# EasyEDA Pro project ProPrj_stm32_2025-12-13.epro

# Schematic Schematic1_1
Board Name: Board1_1; Create Date: 2025-12-13; Page Name: P1; Project Name: stm32; Schematic Name: Schematic1_1; Update Date: 2025-12-13; Company: 嘉立创EDA; Page Size: A4; Version: V1.0
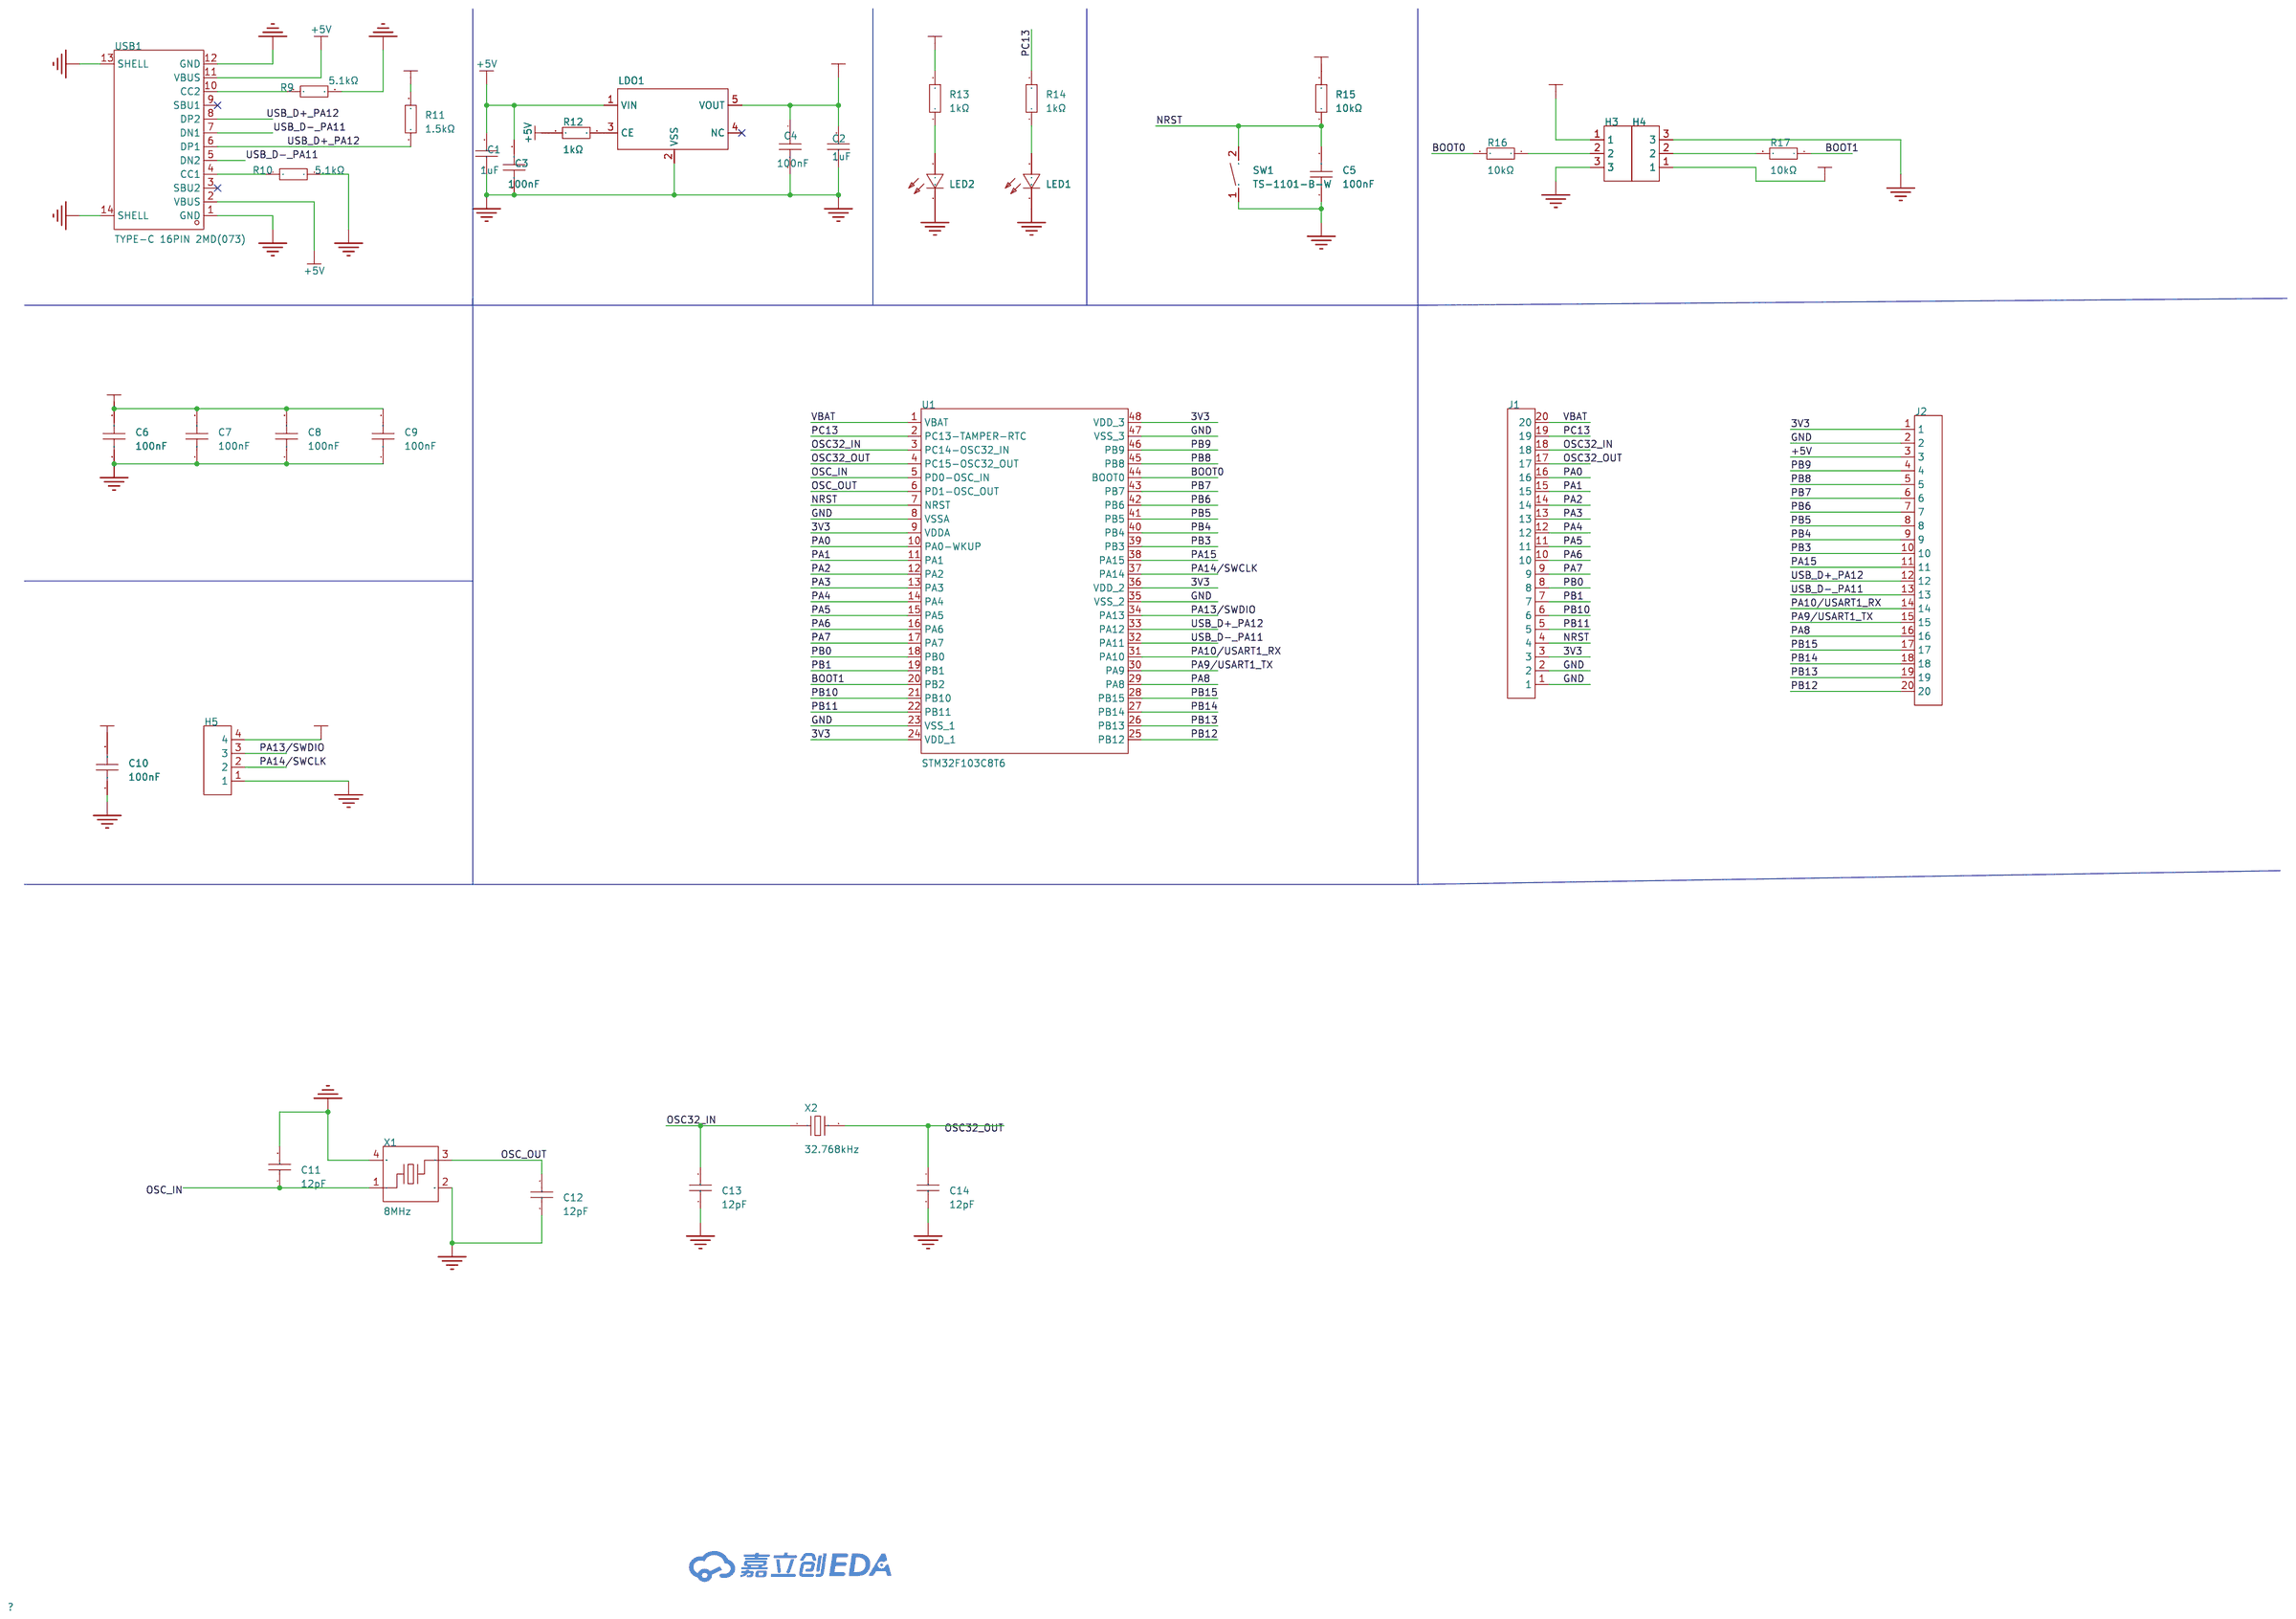
[diagram p0: schematic sheet]

## Parts
C1  1uF  [C0402]
C2  1uF  [C0402]
C3  100nF  [C0402]
C4  100nF  [C0402]
C5  100nF  [C0402]
C6  100nF  [C0402]
C7  100nF  [C0402]
C8  100nF  [C0402]
C9  100nF  [C0402]
C10  100nF  [C0402]
C11  12pF  [C0402]
C12  12pF  [C0402]
C13  12pF  [C0402]
C14  12pF  [C0402]
H3  PZ254V-11-03P  [HDR-TH_3P-P2.54-V-M]
H4  PZ254V-11-03P  [HDR-TH_3P-P2.54-V-M]
H5  DZ254W-11-04-65  [HDR-TH_4P-P2.54-H-M-W10.3]
J1  2.54-1*20P直针  [HDR-TH_20P-P2.54-V-M-1]
J2  2.54-1*20P直针  [HDR-TH_20P-P2.54-V-M-1]
LDO1  ME6211C33M5G-N  [SOT-23-5_L3.0-W1.7-P0.95-LS2.8-BL]
LED1  NCD0603R1  [LED0603-RD_RED]
LED2  NCD0603R1  [LED0603-RD_RED]
R9  5.1kΩ  [R0402]
R10  5.1kΩ  [R0402]
R11  1.5kΩ  [R0402]
R12  1kΩ  [R0603]
R13  1kΩ  [R0402]
R14  1kΩ  [R0402]
R15  10kΩ  [R0402]
R16  10kΩ  [R0402]
R17  10kΩ  [R0402]
SW1  TS-1101-B-W  [KEY-SMD_2P-L6.0-W3.6-P7.4-LS8.0-L]
U1  STM32F103C8T6  [LQFP-48_L7.0-W7.0-P0.50-LS9.0-BL]
USB1  TYPE-C 16PIN 2MD(073)  [USB-C-SMD_TYPE-C-6PIN-2MD-073]
X1  8MHz  [CRYSTAL-SMD_4P-L3.2-W2.5-BL-1]
X2  32.768kHz  [OSC-SMD_L3.2-W1.5]

## Library data of the parts
C1 C2 = CL05A105KP5NNNC: 容值:1uF;精度:±10%;额定电压:10V;温度系数:X5R;; LCSC Part Name: 1uF ±10% 10V; Supplier Part: C14445; Manufacturer: SAMSUNG(三星); Supplier Footprint: 0402; JLCPCB Part Class: 扩展库; Datasheet: https://item.szlcsc.com/datasheet/CL05A105KP5NNNC/15107.html; Supplier: LCSC; Tolerance: ±10%; Voltage Rating: 10V; Temperature Coefficient: X5R
C3-C10 = GRM155R71H104KE14D: 容值:100nF;精度:±10%;额定电压:50V;温度系数:X7R;; LCSC Part Name: 100nF ±10% 50V; Supplier Part: C77020; Manufacturer: muRata(村田); Supplier Footprint: 0402; JLCPCB Part Class: 扩展库; Datasheet: https://item.szlcsc.com/datasheet/GRM155R71H104KE14D/78147.html; Supplier: LCSC; Tolerance: ±10%; Voltage Rating: 50V; Temperature Coefficient: X7R
C11-C14 = 0402CG120J500NT: 容值:12pF;精度:±5%;额定电压:50V;温度系数:C0G;; LCSC Part Name: 12pF ±5% 50V; Supplier Part: C1547; Manufacturer: FH(风华); Supplier Footprint: 0402; JLCPCB Part Class: 基础库; Datasheet: https://item.szlcsc.com/datasheet/0402CG120J500NT/1899.html; Supplier: LCSC; Tolerance: ±5%; Voltage Rating: 50V; Temperature Coefficient: C0G
H3 H4 = PZ254V-11-03P: 插针结构:1x3P;间距:2.54mm;行距:-;圆针/方针:方针;安装方式:直插;排数:单排;总PIN位数:3P;额定电流:3A;额定电压:250V;配合针长度:6mm;塑高:2.5mm;端接针长度:3mm;工作温度:-40℃~+105℃;颜色:黑色;; LCSC Part Name: 1x3P 间距:2.54mm 方针 直插; Supplier Part: C2937625; Manufacturer: XFCN(兴飞); Supplier Footprint: 插件,P=2.54mm; JLCPCB Part Class: 扩展库; Datasheet: https://item.szlcsc.com/datasheet/PZ254V-11-03P/3293280.html; Supplier: LCSC; Pin Structure: 1x3P; Pitch: 2.54mm; Circluar Pins/Square Pins: 方针; Mounting Type: 直插; Number of Rows: 单排; Number of Pins: 3P; Current Rating: 3A; Voltage Rating (Max): 250V; Length of Mating Pin: 6mm; Insulation Height: 2.5mm; Length of End Connection Pin: 3mm; Operating Temperature: -40℃~+105℃; Color: 黑色
H5 = DZ254W-11-04-65: 插针结构:1x4P;间距:2.54mm;行距:-;圆针/方针:方针;安装方式:弯插;排数:单排;总PIN位数:4P;额定电流:3A;额定电压:-;配合针长度:6mm;塑高:2.54mm;端接针长度:-;触头材质:黄铜;触头镀层:金;工作温度:-;颜色:黑色;; LCSC Part Name: 1x4P 间距:2.54mm 方针 弯插; Supplier Part: C2935929; Manufacturer: DEALON(德艺隆); Supplier Footprint: 弯插,P=2.54mm; JLCPCB Part Class: 扩展库; Datasheet: https://item.szlcsc.com/datasheet/DZ254W-11-04-65/3287507.html; Supplier: LCSC; Pin Structure: 1x4P; Pitch: 2.54mm; Circluar Pins/Square Pins: 方针; Mounting Type: 弯插; Number of Rows: 单排; Number of Pins: 4P; Current Rating: 3A; Length of Mating Pin: 6mm; Insulation Height: 2.54mm; Contact Material: 黄铜; Contact Plating: 金; Color: 黑色
J1 J2 = 2.54-1*20P直针: 插针结构:1x20P;间距:2.54mm;行距:-;圆针/方针:方针;安装方式:直插;排数:单排;总PIN位数:20P;额定电流:3A;额定电压:-;配合针长度:-;塑高:-;端接针长度:-;触头材质:黄铜;触头镀层:-;工作温度:-40℃~+105℃;颜色:黑色;; LCSC Part Name: 1x20P 间距:2.54mm 方针 直插; Supplier Part: C50981; Manufacturer: BOOMELE(博穆精密); Supplier Footprint: 插件,P=2.54mm; JLCPCB Part Class: 扩展库; Datasheet: https://item.szlcsc.com/datasheet/2.54-1*20P%25E7%259B%25B4%25E9%2592%2588/51993.html; Supplier: LCSC; Pin Structure: 1x20P; Pitch: 2.54mm; Circluar Pins/Square Pins: 方针; Mounting Type: 直插; Number of Rows: 单排; Number of Pins: 20P; Current Rating: 3A; Contact Material: 黄铜; Operating Temperature: -40℃~+105℃; Color: 黑色
LDO1 = ME6211C33M5G-N: 输出类型:固定;工作电压:6V;输出电压:3.3V;输出电流:500mA;电源纹波抑制比(PSRR):70dB@(1kHz);输出极性:正极;; LCSC Part Name: 输入6V 输出3.3V 500mA; Supplier Part: C82942; Manufacturer: MICRONE(南京微盟); Supplier Footprint: SOT-23-5; JLCPCB Part Class: 扩展库; Datasheet: https://item.szlcsc.com/datasheet/ME6211C33M5G-N/84106.html; Supplier: LCSC; Output Type: 固定; Voltage - Supply: 6V; Output Voltage: 3.3V; Output Current: 500mA; Power Supply Rejection Ratio (PSRR): 70dB@(1kHz); Voltage Dropout: 120mV@(100mA); standby current: 60uA; Noise: 50uVrms; Features: 过流保护；带使能；短路保护; Operating Temperature: -40℃~+150℃; Output Configuration: 正极; Number of Outputs: 1
LED1 LED2 = NCD0603R1_C84263: 灯头类型:-;发光颜色:红色;正向压降(Vf):1.6V~2.6V;功率:65mW;正向电流:25mA;波长:615nm~630nm;二极管配置:独立二极管;透镜颜色:-;色温:-;发光强度:220mcd;发光角度:130°;载带方式:-;工作温度:-30℃~+85℃;; LCSC Part Name: 片式发光二极管; Supplier Part: C84263; Manufacturer: 国星光电; Supplier Footprint: 0603; JLCPCB Part Class: 扩展库; Datasheet: https://item.szlcsc.com/datasheet/NCD0603R1/85432.html; Supplier: LCSC; Illumination Color: 红色; Voltage - Forward(Vf): 1.6V~2.6V; Power(Watts): 65mW; Forward Current: 25mA; Wavelength - Dominant: 615nm~630nm; Peak Wavelength: 630nm; Diode Configuration: 独立二极管; Luminous Intensity: 220mcd; Viewing Angle: 130°; Operating Temperature: -30℃~+85℃
R9 R10 = 0402WGF5101TCE: 电阻类型:厚膜电阻;阻值:5.1kΩ;精度:±1%;功率:62.5mW;工作电压:50V;温度系数:±100ppm/℃;; LCSC Part Name: 5.1kΩ ±1% 62.5mW 厚膜电阻; Supplier Part: C25905; Manufacturer: UNI-ROYAL(厚声); Supplier Footprint: 0402; JLCPCB Part Class: 基础库; Datasheet: https://item.szlcsc.com/datasheet/0402WGF5101TCE/26648.html; Supplier: LCSC; Type: 厚膜电阻; Tolerance: ±1%; Power(Watts): 62.5mW; Voltage-Supply(Max): 50V; Temperature Coefficient: ±100ppm/℃; Operating Temperature: -55℃~+155℃
R11 = 0402WGF1501TCE: 电阻类型:厚膜电阻;阻值:1.5kΩ;精度:±1%;功率:62.5mW;最大工作电压:50V;温度系数:±100ppm/℃;; LCSC Part Name: 1.5kΩ ±1% 62.5mW 厚膜电阻; Supplier Part: C25867; Manufacturer: UNI-ROYAL(厚声); Supplier Footprint: 0402; JLCPCB Part Class: 基础库; Datasheet: https://atta.szlcsc.com/upload/public/pdf/source/20200306/C422600_1E6D84923E4A46A82E41ADD87F860B5C.pdf; Supplier: LCSC; Type: 厚膜电阻; Tolerance: ±1%; Power(Watts): 62.5mW; Overload Voltage (Max): 50V; Temperature Coefficient: ±100ppm/℃; Operating Temperature Range: -55℃~+155℃
R12 = 0603WAF1001T5E: 电阻类型:厚膜电阻;阻值:1kΩ;精度:±1%;功率:100mW;工作电压:75V;温度系数:±100ppm/℃;; LCSC Part Name: 1kΩ ±1% 100mW 厚膜电阻; Supplier Part: C21190; Manufacturer: UNI-ROYAL(厚声); Supplier Footprint: 0603; JLCPCB Part Class: 基础库; Datasheet: https://item.szlcsc.com/datasheet/0603WAF1001T5E/21904.html; Supplier: LCSC; Type: 厚膜电阻; Tolerance: ±1%; Power(Watts): 100mW; Voltage-Supply(Max): 75V; Temperature Coefficient: ±100ppm/℃; Operating Temperature: -55℃~+155℃
R13 R14 = 0402WGF1001TCE: 电阻类型:厚膜电阻;阻值:1kΩ;精度:±1%;功率:62.5mW;工作电压:50V;温度系数:±100ppm/℃;; LCSC Part Name: 1kΩ ±1% 62.5mW 厚膜电阻; Supplier Part: C11702; Manufacturer: UNI-ROYAL(厚声); Supplier Footprint: 0402; JLCPCB Part Class: Basic Part; Datasheet: https://item.szlcsc.com/datasheet/0402WGF1001TCE/12256.html; Supplier: LCSC; Type: 厚膜电阻; Tolerance: ±1%; Power(Watts): 62.5mW; Voltage-Supply(Max): 50V; Temperature Coefficient: ±100ppm/℃; Operating Temperature: -55℃~+155℃
R15-R17 = RC0402FR-0710KL: 电阻类型:厚膜电阻;阻值:10kΩ;精度:±1%;功率:62.5mW;工作电压:50V;温度系数:±100ppm/℃;; LCSC Part Name: 厚膜电阻 10kΩ ±1% 62.5mW; Supplier Part: C60490; Manufacturer: YAGEO(国巨); Supplier Footprint: 0402; JLCPCB Part Class: 扩展库; Datasheet: https://item.szlcsc.com/datasheet/RC0402FR-0710KL/61542.html; Supplier: LCSC; Type: 厚膜电阻; Tolerance: ±1%; Power(Watts): 62.5mW; Voltage-Supply(Max): 50V; Temperature Coefficient: ±100ppm/℃; Operating Temperature: -55℃~+155℃
SW1 = TS-1101-B-W_C500065: 电路结构:单刀单掷;按钮形状:矩形按钮;作用力:1.6N;安装方式:立贴;开关长度:6mm;开关宽度:3.6mm;开关高度:2.5mm;带支架:不带支架;触点电流:50mA;额定电压:12V;带灯:无;工作寿命:5万次;; LCSC Part Name: 6*3.6*2.5mm 立贴 轻触开关; Supplier Part: C500065; Manufacturer: XKB Connection(中国星坤); Supplier Footprint: SMD; JLCPCB Part Class: 扩展库; Datasheet: https://item.szlcsc.com/datasheet/TS-1101-B-W/512191.html; Supplier: LCSC; Circuit: 单刀单掷; Actuator Style: 矩形按钮; Operating Force: 1.6N; Mounting Type: 立贴; Length: 6mm; Width: 3.6mm; Switch Height: 2.5mm; with Bracket: 不带支架; Contact Current: 50mA; Voltage Rating: 12V; Actuator/Cap Color: 白色; With Lamp: 无; Life: 5万次; Operating Temperature: -30℃~+85℃
U1 = STM32F103C8T6: CPU内核:ARM-M3;CPU最大主频:72MHz;应用领域:-;; LCSC Part Name: 主流增强型ARM Cortex-M3 MCU，具有64 KB Flash、72 MHz CPU、电机控制、USB和CAN; Supplier Part: C8734; Manufacturer: ST(意法半导体); Supplier Footprint: LQFP-48(7x7); JLCPCB Part Class: Extended Part; Datasheet: https://item.szlcsc.com/datasheet/STM32F103C8T6/9243.html; Supplier: LCSC; CPU Core: ARM-M3; CPU Maximum Speed: 72MHz; Program Storage Size: 64KB; Program Memory Type: FLASH; Number of I/O: 37; ADC (Bit): 12bit; Voltage - Supply: 2V~3.6V
USB1 = TYPE-C 16PIN 2MD(073): 连接器类型:Type-C;协议标准:-;公母:母;安装方式:卧贴;触点数量:16P;端口数量:1;额定电流 - 电源:3A;工作温度:-25℃~+85℃;; LCSC Part Name: Type-C 母 卧贴; Supplier Part: C2765186; Manufacturer: SHOU HAN(首韩); Supplier Footprint: SMD; JLCPCB Part Class: 扩展库; Datasheet: https://item.szlcsc.com/datasheet/TYPE-C%252016PIN%25202MD(073)/2901843.html; Supplier: LCSC; Connector Type: Type-C; Gender: 母; Mounting Type: 卧贴; Number of Contacts: 16P; Number of Ports: 1; Current Rating-Power: 3A; Voltage Rating: 5V; Connect-Disconnect Life: 5千次; Detection color: 黑色; Operating Temperature: -25℃~+85℃
X1 = XL2EL89COI-111YLC-8M: 晶振类型:贴片晶振;频率:8MHz;常温频差:±10ppm;负载电容:12pF;频率稳定度:±20ppm;; LCSC Part Name: YSX321SL 8MHZ 4P 3225 12PF ±10PPM -40~85℃ (±20PPM); Supplier Part: C2973805; Manufacturer: YXC(扬兴晶振); Supplier Footprint: SMD3225-4P; JLCPCB Part Class: 扩展库; Datasheet: https://item.szlcsc.com/datasheet/XL2EL89COI-111YLC-8M/3371202.html; Supplier: LCSC; Type: 贴片晶振; Normal temperature Frequency Tolerance: ±10ppm; Load Capacitance: 12pF; Frequency Stability: ±20ppm; Equivalent Series Resistance(ESR): 150Ω; Operating Temperature: -40℃~+85℃
X2 = X321532768KGD2SI: 晶振类型:贴片晶振;频率:32.768kHz;常温频差:±20ppm;负载电容:12.5pF;频率稳定度:±30ppm;; LCSC Part Name: YST310S 32.768KHZ 2P 3215 12.5PF ±20PPM -40~85℃; Supplier Part: C620155; Manufacturer: YXC(扬兴晶振); Supplier Footprint: SMD3215-2P; JLCPCB Part Class: Extended Part; Datasheet: https://item.szlcsc.com/datasheet/X321532768KGD2SI/649983.html; Supplier: LCSC; Type: 贴片晶振; Normal temperature Frequency Tolerance: ±20ppm; Load Capacitance: 12.5pF; Frequency Stability: ±30ppm; Operating Temperature: -40℃~+85℃

## Nets
3.3V: C2.2 C4.1 LDO1.5(VOUT) R11.2
3V3: C6.2 C7.2 C8.2 C9.2 C10.2 H3.1 H4.1 H5.4 J1.3 J2.1 R13.2 R15.2 U1.9(VDDA) U1.24(VDD_1) U1.36(VDD_2) U1.48(VDD_3)
+5V: C1.2 C3.1 J2.3 LDO1.1(VIN) R12.1 USB1.2(VBUS) USB1.11(VBUS)
GND: C1.1 C2.1 C3.2 C4.2 C5.1 C6.1 C7.1 C8.1 C9.1 C10.1 C11.2 C12.1 C13.1 C14.1 H3.3 H4.3 H5.1 J1.1 J1.2 J2.2 LDO1.2(VSS) LED1.1(K) LED2.1(K) R9.2 R10.2 SW1.1 U1.8(VSSA) U1.23(VSS_1) U1.35(VSS_2) U1.47(VSS_3) USB1.1(GND) USB1.12(GND) USB1.13(SHELL) USB1.14(SHELL) X1.2(GND) X1.4(GND)
VBAT: J1.20 U1.1(VBAT)
BOOT0: R16.2 U1.44(BOOT0)
BOOT1: R17.1 U1.20(PB2)
NRST: C5.2 J1.4 R15.1 SW1.2 U1.7(NRST)
OSC32_IN: C13.2 J1.18 U1.3(PC14-OSC32_IN) X2.1
OSC32_OUT: C14.2 J1.17 U1.4(PC15-OSC32_OUT) X2.2
OSC_IN: C11.1 U1.5(PD0-OSC_IN) X1.1
OSC_OUT: C12.2 U1.6(PD1-OSC_OUT) X1.3
PA0: J1.16 U1.10(PA0-WKUP)
PA1: J1.15 U1.11(PA1)
PA2: J1.14 U1.12(PA2)
PA3: J1.13 U1.13(PA3)
PA4: J1.12 U1.14(PA4)
PA5: J1.11 U1.15(PA5)
PA6: J1.10 U1.16(PA6)
PA7: J1.9 U1.17(PA7)
PA8: J2.16 U1.29(PA8)
PA9/USART1_TX: J2.15 U1.30(PA9)
PA10/USART1_RX: J2.14 U1.31(PA10)
PA13/SWDIO: H5.3 U1.34(PA13)
PA14/SWCLK: H5.2 U1.37(PA14)
PA15: J2.11 U1.38(PA15)
PB0: J1.8 U1.18(PB0)
PB1: J1.7 U1.19(PB1)
PB3: J2.10 U1.39(PB3)
PB4: J2.9 U1.40(PB4)
PB5: J2.8 U1.41(PB5)
PB6: J2.7 U1.42(PB6)
PB7: J2.6 U1.43(PB7)
PB8: J2.5 U1.45(PB8)
PB9: J2.4 U1.46(PB9)
PB10: J1.6 U1.21(PB10)
PB11: J1.5 U1.22(PB11)
PB12: J2.20 U1.25(PB12)
PB13: J2.19 U1.26(PB13)
PB14: J2.18 U1.27(PB14)
PB15: J2.17 U1.28(PB15)
PC13: J1.19 R14.2 U1.2(PC13-TAMPER-RTC)
USB_D+_PA12: J2.12 R11.1 U1.33(PA12) USB1.6(DP1) USB1.8(DP2)
USB_D-_PA11: J2.13 U1.32(PA11) USB1.5(DN2) USB1.7(DN1)
$1N481: R9.1 USB1.10(CC2)
$1N493: R10.1 USB1.4(CC1)
$1N1175: LDO1.3(CE) R12.2
$1N1788: LED1.2(A) R14.1
$1N1790: LED2.2(A) R13.1
$1N2803: H3.2 R16.1
$1N3005: H4.2 R17.2

Not connected (* = marked no-connect by the designer): LDO1 4(NC)*; USB1 3(SBU2)* 9(SBU1)*

# Board PCB1_1
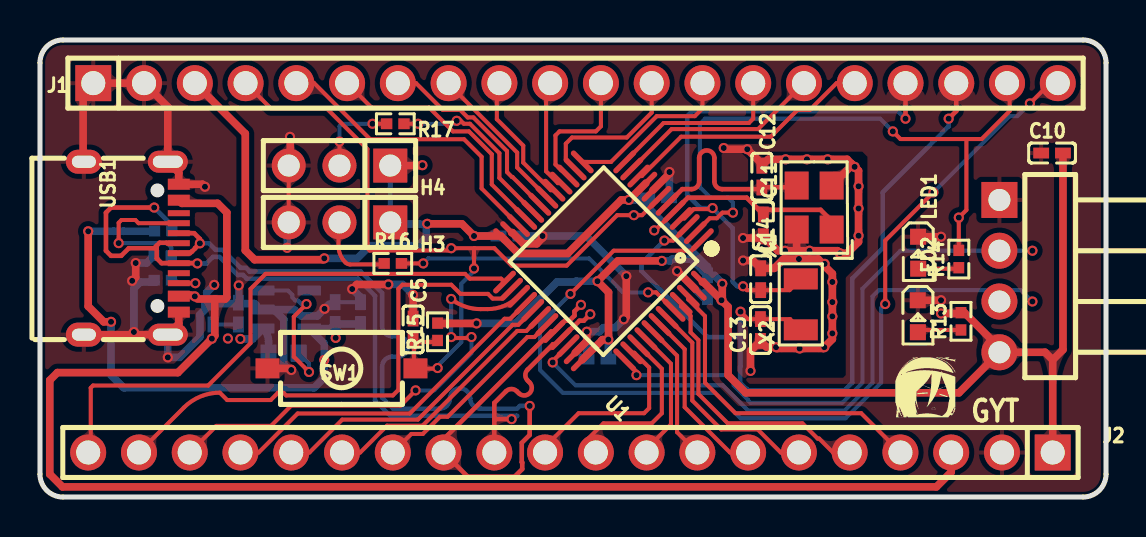
[diagram p1: board, top side]
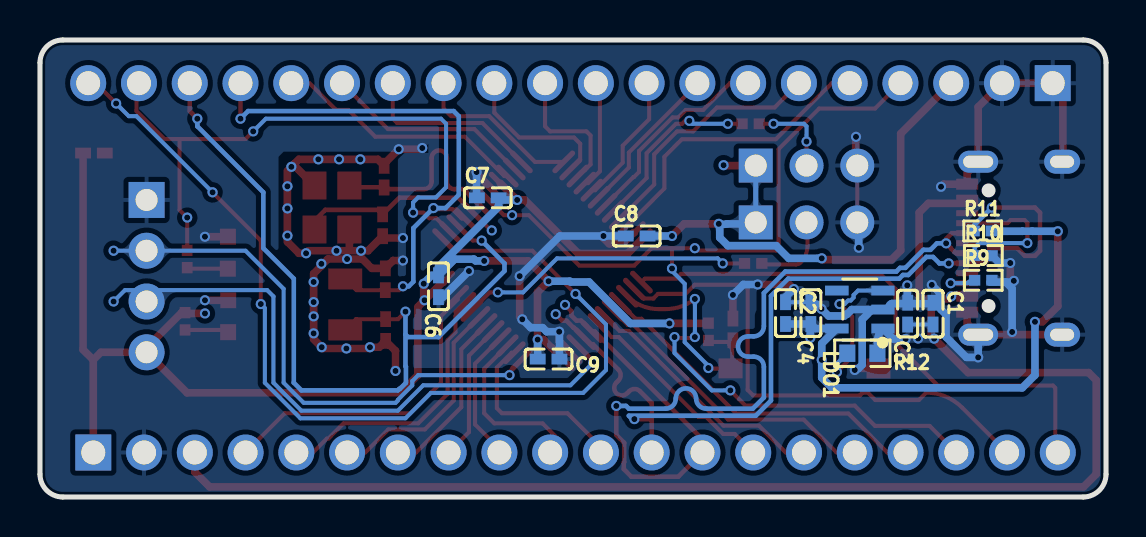
[diagram p2: board, bottom side, seen from below]

Outline 53.34 x 22.86 mm; copper layers: Top Layer, Bottom Layer. Coordinates in mm from the lower left corner of the outline.
Outline path: 0,21.72 0,1.14 arc(0.33,0.33) 1.14,0 52.2,0 arc(53.01,0.33) 53.34,1.14 53.34,21.72 arc(53.01,22.53) 52.2,22.86 1.14,22.86 arc(0.33,22.53) 0,21.72
Stack: Top Layer 0.035mm / Dielectric1 1.51mm FR4 er 4.5 / Bottom Layer 0.035mm

## Design rules (mm)
net +5V: PWR
net GND: PWR
net 3.3V: PWR
net 3V3: PWR
net USB_D-_PA11: DP1
net USB_D+_PA12: DP1
template: 自定义配置
spacing copperThickness1oz (default): track to track 0.102, other pairs 0.152 to 0.3
spacing copperThickness2oz: track to track 0.203, other pairs 0.152 to 0.3
spacing safeClearance1: track to track 0.152, other pairs 0.152 to 0.3
track width copperThickness1oz (default): min 0.127, default 0.203, max 2.54
track width copperThickness2oz: min 0.203, default 0.254, max 2.54
track width PWR: min 0.127, default 0.381, max 2.54
differential pair differentialPair (default): width min 0.127, default 0.229, max 2.54; gap min 0.127, default 0.127
via viaSize (default): diameter min 0.5, default 0.508, max 10; hole min 0.3, default 0.305, max 6.3
net class PWR uses PWR
net +5V uses PWR
net GND uses PWR
net 3.3V uses PWR
net 3V3 uses PWR

## Placement (name value [footprint] x y rotation side)
C1  1uF  [C0402]  8.66 9.17 270 bottom
C2  1uF  [C0402]  16.04 9.2 270 bottom
C3  100nF  [C0402]  9.93 9.17 90 bottom
C4  100nF  [C0402]  14.77 9.2 90 bottom
C5  100nF  [C0402]  18.67 8.38 270 top
C6  100nF  [C0402]  33.4 10.54 90 bottom
C7  100nF  [C0402]  30.93 14.97 180 bottom
C8  100nF  [C0402]  23.48 13.06 180 bottom
C9  100nF  [C0402]  27.89 6.9 0 bottom
C10  100nF  [C0402]  50.64 17.21 0 top
C11  12pF  [C0402]  36.2 13.59 270 top
C12  12pF  [C0402]  36.12 16.03 270 top
C13  12pF  [C0402]  36.05 8.35 90 top
C14  12pF  [C0402]  36.06 10.89 270 top
H3  PZ254V-11-03P  [HDR-TH_3P-P2.54-V-M]  14.99 13.74 180 top
H4  PZ254V-11-03P  [HDR-TH_3P-P2.54-V-M]  14.99 16.58 180 top
H5  DZ254W-11-04-65  [HDR-TH_4P-P2.54-H-M-W10.3]  48.01 11.05 270 top
J1  2.54-1*20P直针  [HDR-TH_20P-P2.54-V-M-1]  26.8 20.7 0 top
J2  2.54-1*20P直针  [HDR-TH_20P-P2.54-V-M-1]  26.54 2.23 180 top
LDO1  ME6211C33M5G-N  [SOT-23-5_L3.0-W1.7-P0.95-LS2.8-BL]  12.32 9.38 90 bottom
LED1  NCD0603R1  [LED0603-RD_RED]  43.94 12.22 270 top
LED2  NCD0603R1  [LED0603-RD_RED]  43.92 9.04 270 top
R9  5.1kΩ  [R0402]  6.14 10.84 180 bottom
R10  5.1kΩ  [R0402]  6.14 12.07 180 bottom
R11  1.5kΩ  [R0402]  6.17 13.31 180 bottom
R12  1kΩ  [R0603]  12.19 7.19 0 bottom
R13  1kΩ  [R0402]  46.08 8.79 90 top
R14  1kΩ  [R0402]  45.97 11.9 90 top
R15  10kΩ  [R0402]  19.89 8.26 90 top
R16  10kΩ  [R0402]  17.65 11.68 0 top
R17  10kΩ  [R0402]  17.78 18.67 180 top
SW1  TS-1101-B-W  [KEY-SMD_2P-L6.0-W3.6-P7.4-LS8.0-L]  15.09 6.43 0 top
U1  STM32F103C8T6  [LQFP-48_L7.0-W7.0-P0.50-LS9.0-BL]  28.19 11.81 135 top
USB1  TYPE-C 16PIN 2MD(073)  [USB-C-SMD_TYPE-C-6PIN-2MD-073]  4.57 12.45 270 top
X1  8MHz  [CRYSTAL-SMD_4P-L3.2-W2.5-BL-1]  38.73 14.48 90 top
X2  32.768kHz  [OSC-SMD_L3.2-W1.5]  38.07 9.64 90 top

## Footprints (pads in the part's own frame, mm; a bottom-side part is the same pattern mirrored in y, then rotated)
C0402
  rect 0.79x0.54 smd: 1(-0.545,0) 2(0.545,0)
CRYSTAL-SMD_4P-L3.2-W2.5-BL-1
  rect 1.4x1.2 smd: 1(-1.1,-0.875) 2(1.1,-0.875) 3(1.1,0.875) 4(-1.1,0.875)
HDR-TH_3P-P2.54-V-M
  rect 1.7x1.7 hole 1.1: 1(-2.54,0)
  round 1.7 hole 1.1: 2(0,0) 3(2.54,0)
HDR-TH_4P-P2.54-H-M-W10.3
  rect 1.8x1.8 hole 1.1: 1(-3.81,0)
  round 1.8 hole 1.1: 2(-1.27,0) 3(1.27,0) 4(3.81,0)
HDR-TH_20P-P2.54-V-M-1
  rect 1.8x1.8 hole 1.2: 1(-24.13,0)
  round 1.8 hole 1.2: 2(-21.59,0) 3(-19.05,0) 4(-16.51,0) 5(-13.97,0) 6(-11.43,0) 7(-8.89,0) 8(-6.35,0) 9(-3.81,0) 10(-1.27,0) 11(1.27,0) 12(3.81,0) 13(6.35,0) 14(8.89,0) 15(11.43,0) 16(13.97,0) 17(16.51,0) 18(19.05,0) 19(21.59,0) 20(24.13,0)
KEY-SMD_2P-L6.0-W3.6-P7.4-LS8.0-L
  rect 1.2x1 smd: 1(-3.7,0) 2(3.7,0)
LED0603-RD_RED
  rect 0.8x0.8 smd: 1(-0.799,-0.004) 2(0.799,0.004)
LQFP-48_L7.0-W7.0-P0.50-LS9.0-BL
  oval 0.27x1.5 smd: 1(-2.75,-4.25) 2(-2.25,-4.25) 3(-1.75,-4.25) 4(-1.25,-4.25) 5(-0.75,-4.25) 6(-0.25,-4.25) 7(0.25,-4.25) 8(0.75,-4.25) 9(1.25,-4.25) 10(1.75,-4.25) 11(2.25,-4.25) 12(2.75,-4.25) 25(2.75,4.25) 26(2.25,4.25) 27(1.75,4.25) 28(1.25,4.25) 29(0.75,4.25) 30(0.25,4.25) 31(-0.25,4.25) 32(-0.75,4.25) 33(-1.25,4.25) 34(-1.75,4.25) 35(-2.25,4.25) 36(-2.75,4.25)
  oval 1.5x0.27 smd: 13(4.25,-2.75) 14(4.25,-2.25) 15(4.25,-1.75) 16(4.25,-1.25) 17(4.25,-0.75) 18(4.25,-0.25) 19(4.25,0.25) 20(4.25,0.75) 21(4.25,1.25) 22(4.25,1.75) 23(4.25,2.25) 24(4.25,2.75) 37(-4.25,2.75) 38(-4.25,2.25) 39(-4.25,1.75) 40(-4.25,1.25) 41(-4.25,0.75) 42(-4.25,0.25) 43(-4.25,-0.25) 44(-4.25,-0.75) 45(-4.25,-1.25) 46(-4.25,-1.75) 47(-4.25,-2.25) 48(-4.25,-2.75)
OSC-SMD_L3.2-W1.5
  rect 1.05x1.7 smd: 1(-1.275,0) 2(1.275,0)
R0402
  rect 0.566x0.54 smd: 1(-0.433,0) 2(0.433,0)
R0603
  rect 0.806x0.864 smd: 1(-0.753,0) 2(0.753,0)
SOT-23-5_L3.0-W1.7-P0.95-LS2.8-BL
  rect 0.49x1.157 smd: 1(-0.95,-1.153) 2(0,-1.153) 3(0.95,-1.153)
  rect 0.49x1.175 smd: 4(0.95,1.153) 5(-0.95,1.153)
USB-C-SMD_TYPE-C-6PIN-2MD-073
  rect 0.55x1.1 smd: 1(-3.2,2.375) 2(-2.4,2.375) 11(2.4,2.375) 12(3.2,2.375)
  rect 0.3x1.1 smd: 3(-1.75,2.375) 4(-1.25,2.375) 5(-0.75,2.375) 6(-0.25,2.375) 7(0.25,2.375) 8(0.75,2.375) 9(1.25,2.375) 10(1.75,2.375)
  oval 1.1x2 hole 0.6x1.5: 13(-4.325,1.825) 14(4.325,1.825)
  oval 1.2x1.8 hole 0.6x1.2: 13(-4.325,-2.375) 14(4.325,-2.375)

## Nets
As in the schematic.

Pads without a net: LDO1 4; USB1 3 9

## Via types
v1: diameter 0.508, hole 0.305, Top Layer to Bottom Layer, 109 vias

## Routing (per net, layer and track width the routed paths; a pad name or vN(x,y) marks a point on that pad's centre or on a via; arc(x,y) is an arc through that point)
3.3V: length 28.5
  Top Layer w0.381: v1(2.41,13.29) 2.41,9.54 3.19,8.76 v1(3.56,8.76)
  Bottom Layer w0.381: C4.1 14.8,8.63 v1(14.8,7.96) ; C4.1 14.54,8.43 LDO1.5 14.22,7.67 v1(14.22,6.86) 14.22,5.97 13.72,5.46 4.19,5.46 3.56,6.1 v1(3.56,8.76) ; C4.1 C2.2 ; v1(2.41,13.29) 3.68,13.29 3.69,13.3 4.18,13.3 4.19,13.29 5.77,13.29
3V3: length 111
  Top Layer w0.381: H5.4 48.01,7.47 46.25,9.22 R13.2 46.04,9.18 v1(45.08,9.18) ; H5.4 50.29,7.24 50.67,6.86 ; H5.4 45.98,5.21 35.31,5.21 34.43,6.1 34.43,9.51 v1(34.1,9.84) ; v1(31.11,11.81) 28.91,11.81 v1(27.89,10.79) 28.45,10.24 28.45,7.88 v1(28.44,7.87) 28.15,7.87 28.11,7.83 28.11,7.82 27.76,7.47 27.75,7.47 U1.36 ; v1(34.1,9.84) 33.19,10.75 U1.48 ; v1(34.1,9.84) 34.14,9.88 v1(34.14,10.67) ; 17.68,16.58 19.09,16.58 arc(19.11,16.58) v1(19.14,16.6) ; v1(14.22,11.94) 14.16,11.87 10.74,11.87 10.27,12.33 10.27,18.17 J1.3 ; 50.67,6.86 51.18,7.37 C10.2 ; 50.67,6.86 J2.1 ; v1(21.84,8.68) 19.84,8.68 ; U1.9 29.47,14.86 v1(29.46,14.86) 29.08,14.86 26.41,12.18 23.93,12.18 U1.24 23.06,13.06 v1(21.72,13.06) 21.11,13.66 v1(19.38,13.66)
  Bottom Layer w0.254: H4.1 H3.1
  Bottom Layer w0.381: C8.2 v1(21.72,13.06) ; 34.16,10.67 33.74,11.09 C6.2 ; v1(29.46,14.86) 30.28,14.86 C7.2 30.39,14.52 33.4,11.51 C6.2 ; v1(14.22,11.94) 15.87,11.94 16.51,12.57 18.92,12.57 19.33,12.98 19.33,13.65 ; C6.2 32.59,11.9 31.63,11.9 31.54,11.81 v1(31.11,11.81) ; v1(27.89,10.79) 26.83,10.79 26.79,10.76 25.87,10.76 23.8,8.68 v1(21.84,8.68) ; 19.33,13.65 19.33,13.66 ; 19.33,13.65 arc(19.35,13.66) v1(19.38,13.66) ; 19.33,13.65 arc(19.15,13.64) 18.98,13.66 17.58,13.66 ; C9.2 v1(28.44,7.87)
+5V: length 75.5
  Top Layer w0.381: 8.75,9.91 7.88,9.91 ; 8.75,9.91 8.75,8.07 v1(8.6,7.92) 6.9,6.22 0.87,6.22 0.49,5.84 0.49,1.14 1.13,0.51 44.85,0.51 45.59,1.25 J2.3 ; 8.75,9.91 9.27,9.91 9.35,9.99 9.35,14.23 8.89,14.69 7.1,14.69 USB1.2 ; USB1.11 7.23,10.05 arc(7.49,10.11) v1(7.75,10.04)
  Bottom Layer w0.2: C1.2 C3.1
  Bottom Layer w0.381: R12.1 11.44,7.76 arc(11.37,8.12) LDO1.1 10.64,7.91 v1(10.03,7.91)
  vias: v1(9.4,7.93)
GND: length 111.4
  Top Layer w0.2: H4.3 H3.3
  Top Layer w0.381: 34.32,17.4 v1(35.39,17.4) 36.02,16.77 ; X1.2 40.61,16.58 40.61,16.66 ; 37.92,12.32 v1(38.5,12.32) 39.9,12.32 v1(40.03,12.19) 40.39,12.19 40.96,12.76 v1(40.96,13.07) v1(40.96,14.43) v1(40.96,15.54) 40.96,16.32 40.61,16.66 ; 37.92,12.32 37.86,12.37 X1.4 ; 37.92,12.32 v1(37.28,12.32) 36.92,12.32 C11.2 36.11,12.95 v1(35.18,12.95) ; 2.2,16.77 2.16,16.81 2.16,20.19 2.67,20.7 J1.2 6.4,19.51 6.4,16.77 6.95,16.22 USB1.1 8.13,15.65 v1(8.26,15.52) ; v1(29.34,11.05) 29.34,9.02 v1(29.21,8.89) ; v1(31.88,11.3) 31.88,11.3 32.79,10.4 ; U1.23 23.63,13.23 24.19,12.67 24.86,12.67 25.15,12.95 v1(25.15,13.06) ; 40.61,16.66 40.39,16.89 v1(39.41,16.89) v1(38.38,16.89) v1(37.31,16.89) 36.44,16.89 C12.1 ; 30.67,15.35 31.5,16.17 v1(31.5,16.26) ; USB1.12 6.95,8.67 6.4,8.12 USB1.14 ; v1(4.61,10.81) 4.79,10.99 v1(4.79,11.7) ; C5.1 18.67,10.16 ; v1(35.18,11.83) 35.67,11.83 C14.1 36.74,11.44 37.2,11.9 v1(37.97,11.9) 38.93,11.9 39.26,11.58 39.26,11.55 39.65,11.17 v1(39.65,10.76) v1(39.65,9.75) v1(39.65,9.04) v1(39.65,8.18) 39.65,7.9 v1(39.24,7.49) 39.18,7.43 v1(38.01,7.43) 36.89,7.43 v1(36.83,7.49) 36.36,7.49 36.05,7.81 35.55,7.31 v1(35.55,6.31) ; LED2.1 v1(45.08,9.84) ; U1.35 27.36,7.8 v1(27.36,8.27) ; 12.52,16.86 12.52,17.98 arc(12.52,18) v1(12.51,18.02) ; v1(15.62,10.4) 15.85,10.63 v1(17.43,10.63) ; LED1.1 v1(45.08,13.02) ; SW1.1 12.57,6.43
  Bottom Layer w0.2: 14.88,9.74 C2.1
  Bottom Layer w0.381: R10.2 5.34,11.7 v1(4.79,11.7) ; v1(31.88,11.3) 33.18,10 C6.1 ; 6.4,8.12 v1(6.4,6.99) 6.98,6.99 8,8 8,9.12 8.26,9.37 8.26,9.7 8.34,9.79 8.34,10.24 v1(8.72,10.61) ; 5.02,10.75 4.61,10.75 ; 5.02,10.75 4.7,10.43 v1(4.7,8.26) ; 5.02,10.75 5.8,10.75 ; 11.71,9.38 12.72,9.38 12.95,9.14 13,9.14 13.09,9.06 13.88,9.06 v1(14.24,9.41) 14.48,9.65 ; 11.71,9.38 12.2,8.88 12.2,6.62 12.4,6.42 12.51,6.42 v1(12.57,6.35) ; 11.71,9.38 LDO1.2 ; v1(31.5,16.26) 31.5,14.98 C7.1 ; v1(27.36,8.27) 27.99,8.27 28.19,8.47 28.79,8.47 v1(29.21,8.89) ; C2.1 16.04,10 15.62,10.41 ; 12.37,13.67 12.37,12.48 arc(12.37,12.47) v1(12.37,12.47) ; v1(18.67,10.11) 18.15,10.63 v1(17.43,10.63) ; C9.1 27.35,8.26 ; 24.03,13.06 v1(25.15,13.06) 27.33,13.06 v1(29.34,11.05) ; v1(9.95,10.59) 9.95,9.93 arc(9.94,9.92) 9.94,9.92 ; 8.81,9.68 10.71,9.68 arc(10.83,9.59) 10.85,9.45
  vias: v1(34.21,17.46) v1(39.26,11.66) v1(40.76,16.52)
VBAT: length 50.1
  Top Layer w0.203: v1(49.53,19.69) 50.55,20.7 J1.20 ; v1(26.54,10.16) 28.7,12.32 32.59,12.32 U1.1 ; v1(42.29,9.65) 42.29,12.83 v1(44.7,15.24)
  Bottom Layer w0.203: v1(49.53,19.69) 48.89,19.05 48.51,19.05 v1(44.7,15.24) ; v1(42.29,9.65) 42.09,9.45 42.09,5.72 40.31,3.94 35.05,3.94 33.78,5.21 26.16,5.21 25.02,6.35 25.02,8.64 v1(26.54,10.16)
BOOT0: length 14.8
  Top Layer w0.203: R16.2 v1(19.18,11.68) ; U1.44 30.83,10.24 v1(30.43,10.24)
  Bottom Layer w0.203: v1(30.43,10.24) 29.17,10.24 27.47,11.94 19.43,11.94 v1(19.18,11.68)
BOOT1: length 9
  Top Layer w0.203: U1.20 22.99,15.96 22.99,17.2 21.51,18.67 21.21,18.67 20.95,18.92 ; 18.21,18.67 v1(18.92,18.67)
  Bottom Layer w0.203: v1(20.85,18.82) 20.7,18.67 v1(18.92,18.67)
NRST: length 38.7
  Top Layer w0.203: v1(20.57,12.45) 21.74,12.45 ; 21.74,12.45 22.73,12.45 23.61,11.57 26.36,11.57 28.88,14.1 v1(29.72,14.1) 30.13,14.1 31.02,14.99 ; 21.74,12.45 21.72,12.42 v1(21.72,11.43) ; 18.85,7.75 19.69,7.75 arc(19.75,7.77) 19.81,7.81 ; 18.94,6.42 19.82,6.42 arc(19.86,6.43) v1(19.9,6.45) ; 10.29,20.7 11.56,19.43 14.35,19.43 16.38,17.4 16.38,12.45 16.5,12.33 20.57,12.33 ; 18.71,6.44 18.71,7.27 arc(18.75,7.46) 18.85,7.62
  Bottom Layer w0.203: 21.72,11.3 21.08,10.67 21.08,7.75 19.9,6.56 v1(19.9,6.45)
OSC32_IN: length 39.9
  Top Layer w0.203: v1(35.05,9.27) 35.43,8.9 C13.2 37.53,8.9 X2.1 ; v1(31.24,12.83) 31.68,12.83 U1.3
  Top Layer w0.229: 45.85,20.7 45.85,19.3 v1(45.47,18.92)
  Bottom Layer w0.229: 35.05,8.13 35.05,6.54 35.03,6.52 35.03,5.71 35.34,5.41 35.36,5.41 35.43,5.33 40.26,5.33 40.64,5.72 40.64,10.92 42.16,12.45 42.16,15.24 45.47,18.54 v1(45.47,18.92) ; 35.05,8.13 34.92,8 33.4,8 30.1,11.3 30.1,11.68 v1(31.24,12.83) ; 35.05,8.13 v1(35.05,9.27)
OSC32_OUT: length 28.2
  Top Layer w0.203: v1(35.18,10.54) 35.37,10.35 37.51,10.35 X2.2 ; 33.65,14.48 33.58,14.4 32.71,14.4 32.24,13.93 32.08,13.93
  Top Layer w0.229: J1.17 v1(43.31,18.92)
  Bottom Layer w0.229: v1(35.18,10.54) 34.89,10.54 34.66,10.77 34.66,13.45 v1(33.65,14.45) 33.05,14.45 32.39,15.11 32.39,19.05 32.64,19.3 42.93,19.3 v1(43.31,18.92)
OSC_IN: length 10.4
  Top Layer w0.203: v1(30.73,13.34) 30.78,13.34 U1.5
  Top Layer w0.229: 39.7,13.72 39.06,14.37 36.43,14.37 C11.1 35.36,14.97 32.42,14.97 U1.5
OSC_OUT: length 10
  Top Layer w0.229: C12.2 36.13,15.49 37.85,15.49 ; 36.07,15.4 34.13,15.4 arc(33.86,15.51) 33.74,15.78 33.74,16.96 arc(33.36,17.34) 32.98,16.96 32.98,15.78 arc(32.87,15.51) 32.6,15.4 32.14,15.4 U1.6
PA0: length 12.7
  Top Layer w0.203: J1.16 39.86,20.7 38.52,19.36 37.9,19.36 36.56,18.02 32.08,18.02 30.11,16.05 U1.10
PA1: length 10.4
  Top Layer w0.203: 29.61,16.41 31.6,18.4 35.93,18.4 38.23,20.7
PA2: length 9.1
  Top Layer w0.203: U1.12 31.2,18.71 35.47,18.71 35.69,18.92 35.69,20.7
PA3: length 8.4
  Top Layer w0.203: U1.13 28.57,16.76 30.86,19.05 32.77,19.05 33.15,19.43 J1.13
PA4: length 7.9
  Top Layer w0.203: 26.78,16.41 26.31,16.88 26.31,17.67 26.62,17.98 29.36,17.98 30.61,19.23 30.61,20.7
PA5: length 7.4
  Top Layer w0.203: 27.46,20.25 27.75,20.55 ; U1.15 26.14,16.35 26.08,16.35 25.79,16.64 25.79,18.09 26,18.29 27.81,18.29 28.07,18.54 28.07,20.7
PA6: length 5.5
  Top Layer w0.203: U1.16 25.92,15.7 25.32,16.29 25.32,20.5 J1.10
PA7: length 6.7
  Top Layer w0.203: J1.9 22.86,20.57 22.86,18.9 24.18,17.58 24.18,16.73 25.56,15.35 25.72,15.35
PA8: length 15
  Top Layer w0.203: U1.29 23.93,8.61 23.65,8.61 18.91,3.87 15.13,3.87 13.48,2.23 J2.16
PA9/USART1_TX: length 12.7
  Top Layer w0.203: U1.30 24.34,8.31 23.88,8.31 19.14,3.57 17.36,3.57 16.02,2.23 J2.15
PA10/USART1_RX: length 10.4
  Top Layer w0.203: U1.31 24.74,8 24.38,8 20.4,4.01 20.02,4.01 19.15,3.15 18.58,3.15 17.65,2.23
PA13/SWDIO: length 31.4
  Top Layer w0.203: v1(25.65,6.73) 25.65,6.8 U1.34
  Bottom Layer w0.203: v1(49.66,9.78) 49.09,10.35 41.97,10.35 41.66,10.03 41.66,5.72 40.26,4.32 35.43,4.32 34.16,5.59 26.8,5.59 v1(25.65,6.73)
PA14/SWCLK: length 27.4
  Top Layer w0.203: v1(29.84,6.1) 29.84,6.27 U1.37
  Bottom Layer w0.203: v1(49.66,12.32) H5.2 43.05,12.32 41.15,10.41 41.15,5.72 40.14,4.71 35.55,4.71 35.43,4.83 35.43,4.86 34.71,5.58 34.71,5.8 34.42,6.1 v1(29.84,6.1)
PA15: length 9.5
  Top Layer w0.203: U1.38 29.74,7.22 30.48,6.48 30.48,4.45 30.23,4.19 26.95,4.19 25.27,2.51 25.27,2.23
PB0: length 7.7
  Top Layer w0.203: 25.37,14.99 23.88,16.48 23.88,17.23 20.45,20.66 20.45,20.7
PB1: length 10.2
  Top Layer w0.203: J1.7 18.82,20.7 20.16,19.36 21.02,19.36 21.4,18.99 21.69,18.99 23.37,17.31 23.37,16.26 23.62,16 23.65,16 U1.19
PB3: length 8.9
  Top Layer w0.203: J2.10 27.42,2.62 27.42,2.91 28.19,3.68 30.61,3.68 31.11,4.19 31.11,6.42 U1.39
PB4: length 6.7
  Top Layer w0.203: U1.40 31.57,6.67 31.57,3.63 30.61,2.67 30.61,2.48 J2.9
PB5: length 7
  Top Layer w0.203: J2.8 31.88,3.24 31.88,7.07 30.67,8.28
PB6: length 8.8
  Top Layer w0.203: J2.7 34.52,2.23 32.26,4.49 32.26,7.39 U1.42
PB7: length 11.1
  Top Layer w0.203: J2.6 37.06,2.23 35.91,3.38 34.08,3.38 32.64,4.83 32.64,7.72 U1.43
PB8: length 13.7
  Top Layer w0.203: J2.5 39.68,2.23 38.99,2.92 38.91,2.92 38.15,3.69 34.41,3.69 32.94,5.16 32.94,7.85 32.55,8.24 32.55,9.06 32.08,9.53 32.08,9.69
PB9: length 15.9
  Top Layer w0.203: 43.05,2.23 41.09,4.19 34.8,4.19 33.27,5.72 33.27,9.05 32.44,9.89 U1.46
PB10: length 12.6
  Top Layer w0.203: J1.6 16.59,19.48 19.47,19.48 20.66,18.29 21.46,18.29 22.61,17.15 22.61,15.63 24.3,13.93
PB11: length 15
  Top Layer w0.203: J1.5 13.72,20.7 16.52,17.9 21.22,17.9 22.1,17.02 22.1,15.43 U1.22
PB12: length 28.1
  Top Layer w0.203: J2.20 2.54,2.35 2.54,5.46 2.65,5.58 8.41,5.58 10.53,7.7 10.53,10.41 11.29,11.16 21.27,11.16 21.51,10.92 23.07,10.92 U1.25
PB13: length 25.9
  Top Layer w0.203: J2.19 7.2,4.48 arc(8.02,5.03) 9,5.22 9.37,4.85 11.55,4.85 11.91,5.22 arc(12.05,5.22) 12.19,5.21 12.32,5.08 17.65,5.08 17.93,5.36 17.93,10.41 18.14,10.62 20.58,10.62 21.04,10.16 22.42,10.16 22.65,9.93 23.13,9.93 23.6,10.4
PB14: length 23.6
  Top Layer w0.203: v1(21.59,8) 21.54,7.95 20.57,7.95 ; 7.49,2.23 8.82,3.56 11.56,3.56 12.57,4.57 18.03,4.57 v1(18.8,5.33) ; U1.27 arc(23.24,9.57) 22.39,9.4 22.05,9.4 arc(21.27,9.53) v1(20.57,9.91)
  Bottom Layer w0.203: v1(20.57,9.91) 20.57,9.9 20.57,7.95 ; v1(18.8,5.33) 19.72,5.33 21.59,7.2 v1(21.59,8)
  vias: v1(20.57,8)
PB15: length 17.4
  Top Layer w0.203: J2.17 10.94,2.23 12.89,4.18 18.51,4.18 23.24,8.92 23.53,8.92 24.3,9.69
PC13: length 31.7
  Top Layer w0.203: 46.33,17.91 47.12,17.91 48.51,19.3 48.51,20.57 48.39,20.7 ; 46.33,17.91 46.36,17.88 46.36,14.36 v1(45.97,13.98) R14.2 ; 46.33,17.91 43.05,17.91 v1(42.67,18.29) ; v1(34.67,14.22) 34.14,14.22 33.87,13.94 33.51,13.94 U1.2
  Bottom Layer w0.203: v1(34.67,14.22) 34.67,14.73 34.42,14.99 33.53,14.99 33.02,15.49 33.02,18.67 33.27,18.92 42.04,18.92 v1(42.67,18.29)
USB_D+_PA12: length 46.8
  Top Layer w0.229: 5.84,12.57 5.99,12.72 6.33,12.72 6.35,12.7 USB1.6 ; 5.84,12.57 5.84,11.94 6.08,11.7 USB1.8 7.86,11.7 v1(7.87,11.68) ; 5.84,12.57 5.71,12.45 4.45,12.45 4.06,12.07 3.56,12.07 3.3,12.32 3.3,14.22 3.56,14.48 v1(5.71,14.48) ; 22.73,3.83 22.8,3.9 v1(23.6,3.9) ; 22.73,3.83 J2.12 ; 22.73,3.83 22.73,4.7 23.32,5.29 arc(23.59,5.4) 23.86,5.29 23.96,5.19 arc(24.5,5.19) 24.5,5.73 24.4,5.83 arc(24.29,6.1) 24.4,6.37 25.67,7.64 25.79,7.64 U1.33 26.62,8.47 26.65,8.47 26.99,8.82 27.21,8.82 v1(27.54,9.14)
  Bottom Layer w0.229: v1(5.71,14.48) 6.6,13.59 R11.1 ; v1(23.6,3.9) 23.71,3.9 23.88,4.06 17.53,4.06 16.76,4.83 16.76,10.06 15.9,10.92 10.35,10.92 10.16,11.11 9.89,11.11 8.99,12.01 8.66,12.01 8.33,11.68 v1(7.87,11.68)
USB_D-_PA11: length 47
  Top Layer w0.229: USB1.5 7.71,13.2 8,12.91 v1(8,12.69) 7.76,12.45 7.76,12.44 7.61,12.28 7.59,12.28 7.51,12.2 USB1.7 ; v1(27.07,9.61) 26.74,9.29 26.74,9.07 26.5,8.82 26.27,8.82 25.72,8.28 25.58,8.28 20.19,2.89 J2.13 21.4,1.02 23.75,1.02 24.13,1.4 24.13,1.72 24.11,1.74 24.11,2.71 24.5,3.11 v1(24.5,4.56)
  Bottom Layer w0.229: v1(24.5,4.56) 24.01,4.56 23.88,4.42 22.04,4.42 arc(21.68,4.57) 21.53,4.93 arc(21.02,5.44) 20.51,4.93 arc(20.36,4.57) 20,4.42 17.67,4.42 17.12,4.97 17.12,6.51 arc(17.27,6.87) 17.63,7.02 17.91,7.02 arc(18.42,7.53) 17.91,8.04 17.63,8.04 arc(17.27,8.19) 17.12,8.54 17.12,10.21 16.05,11.28 10.49,11.28 10.31,11.46 10.04,11.46 9.14,12.36 8.79,12.36 8.46,12.69 v1(8,12.69)
$1N481: length 2.2
  Top Layer w0.203: USB1.10 v1(7.77,10.7)
  Bottom Layer w0.203: v1(7.77,10.7) 6.93,10.7 6.89,10.74 arc(6.71,10.85) 6.51,10.89
$1N493: length 7.3
  Top Layer w0.203: USB1.4 4.93,13.7 4.77,13.86 4.08,13.86 3.94,13.72 v1(3.94,12.7)
  Bottom Layer w0.203: v1(3.94,12.7) 6.35,12.7 6.57,12.48 R10.1
$1N1175: length 7.7
  Top Layer w0.203: v1(13.33,9.65) 12.7,9.02 12.7,7.02 v1(13.46,6.26)
  Bottom Layer w0.203: LDO1.3 12.41,10.33 12.63,10.1 12.63,9.98 12.78,9.83 12.91,9.83 13.08,9.65 v1(13.33,9.65) ; R12.2 13.46,6.68 13.46,6.22
$1N1788: length 2.1
  Top Layer w0.203: R14.1 45.92,11.42 LED1.2
$1N1790: length 2.2
  Top Layer w0.203: R13.1 44.04,8.36 LED2.2
$1N2803: length 4
  Top Layer w0.203: 17.15,11.63 15.52,11.63 arc(15.39,11.66) 15.29,11.73 arc(15.03,12.12) 14.93,12.58 14.93,13.73
$1N3005: length 4.4
  Top Layer w0.203: R17.2 v1(16.64,18.67) ; H4.2 v1(14.99,17.78)
  Bottom Layer w0.203: v1(16.64,18.67) 15.11,18.67 14.99,18.54 v1(14.99,17.78)

## Copper pours and planes (outline as drawn; the poured copper is in the pictures)
+5V on Bottom Layer: 8.38,8.99 8.27,9.01 8.16,9.07 8.16,7.92 8.18,7.81 8.25,7.72 10.12,7.72 10.33,7.76 10.52,7.89 10.52,7.77 10.67,7.03 11.09,6.4 11.27,6.4 11.83,6.51 12.3,6.83 12.06,7.19 11.97,7.61 11.97,8.86 11.83,8.96 11.66,8.99
GND on Top Layer: -3.3,26.16 59.44,26.16 59.44,-1.78 -3.3,-1.78
GND on Bottom Layer: -3.3,26.29 57.91,26.29 57.91,-3.05 -3.3,-3.05
3.3V on Bottom Layer: 12.8,9.13 12.8,8.14 12.81,8.09 12.83,8.06 16.96,8.06 17.15,8.09 17.32,8.2 17.32,9.05 17.3,9.15 17.24,9.23 12.92,9.23 12.9,9.23 12.88,9.22

Small or netless copper shapes (teardrops, artwork), in the pictures only: 277 on Top Layer, 116 on Bottom Layer

## Text on the board
Top Silkscreen Layer: GYT
